# EAGLE schematic GloveControl_Module_20200316_0 (EAGLE 9.3.2)
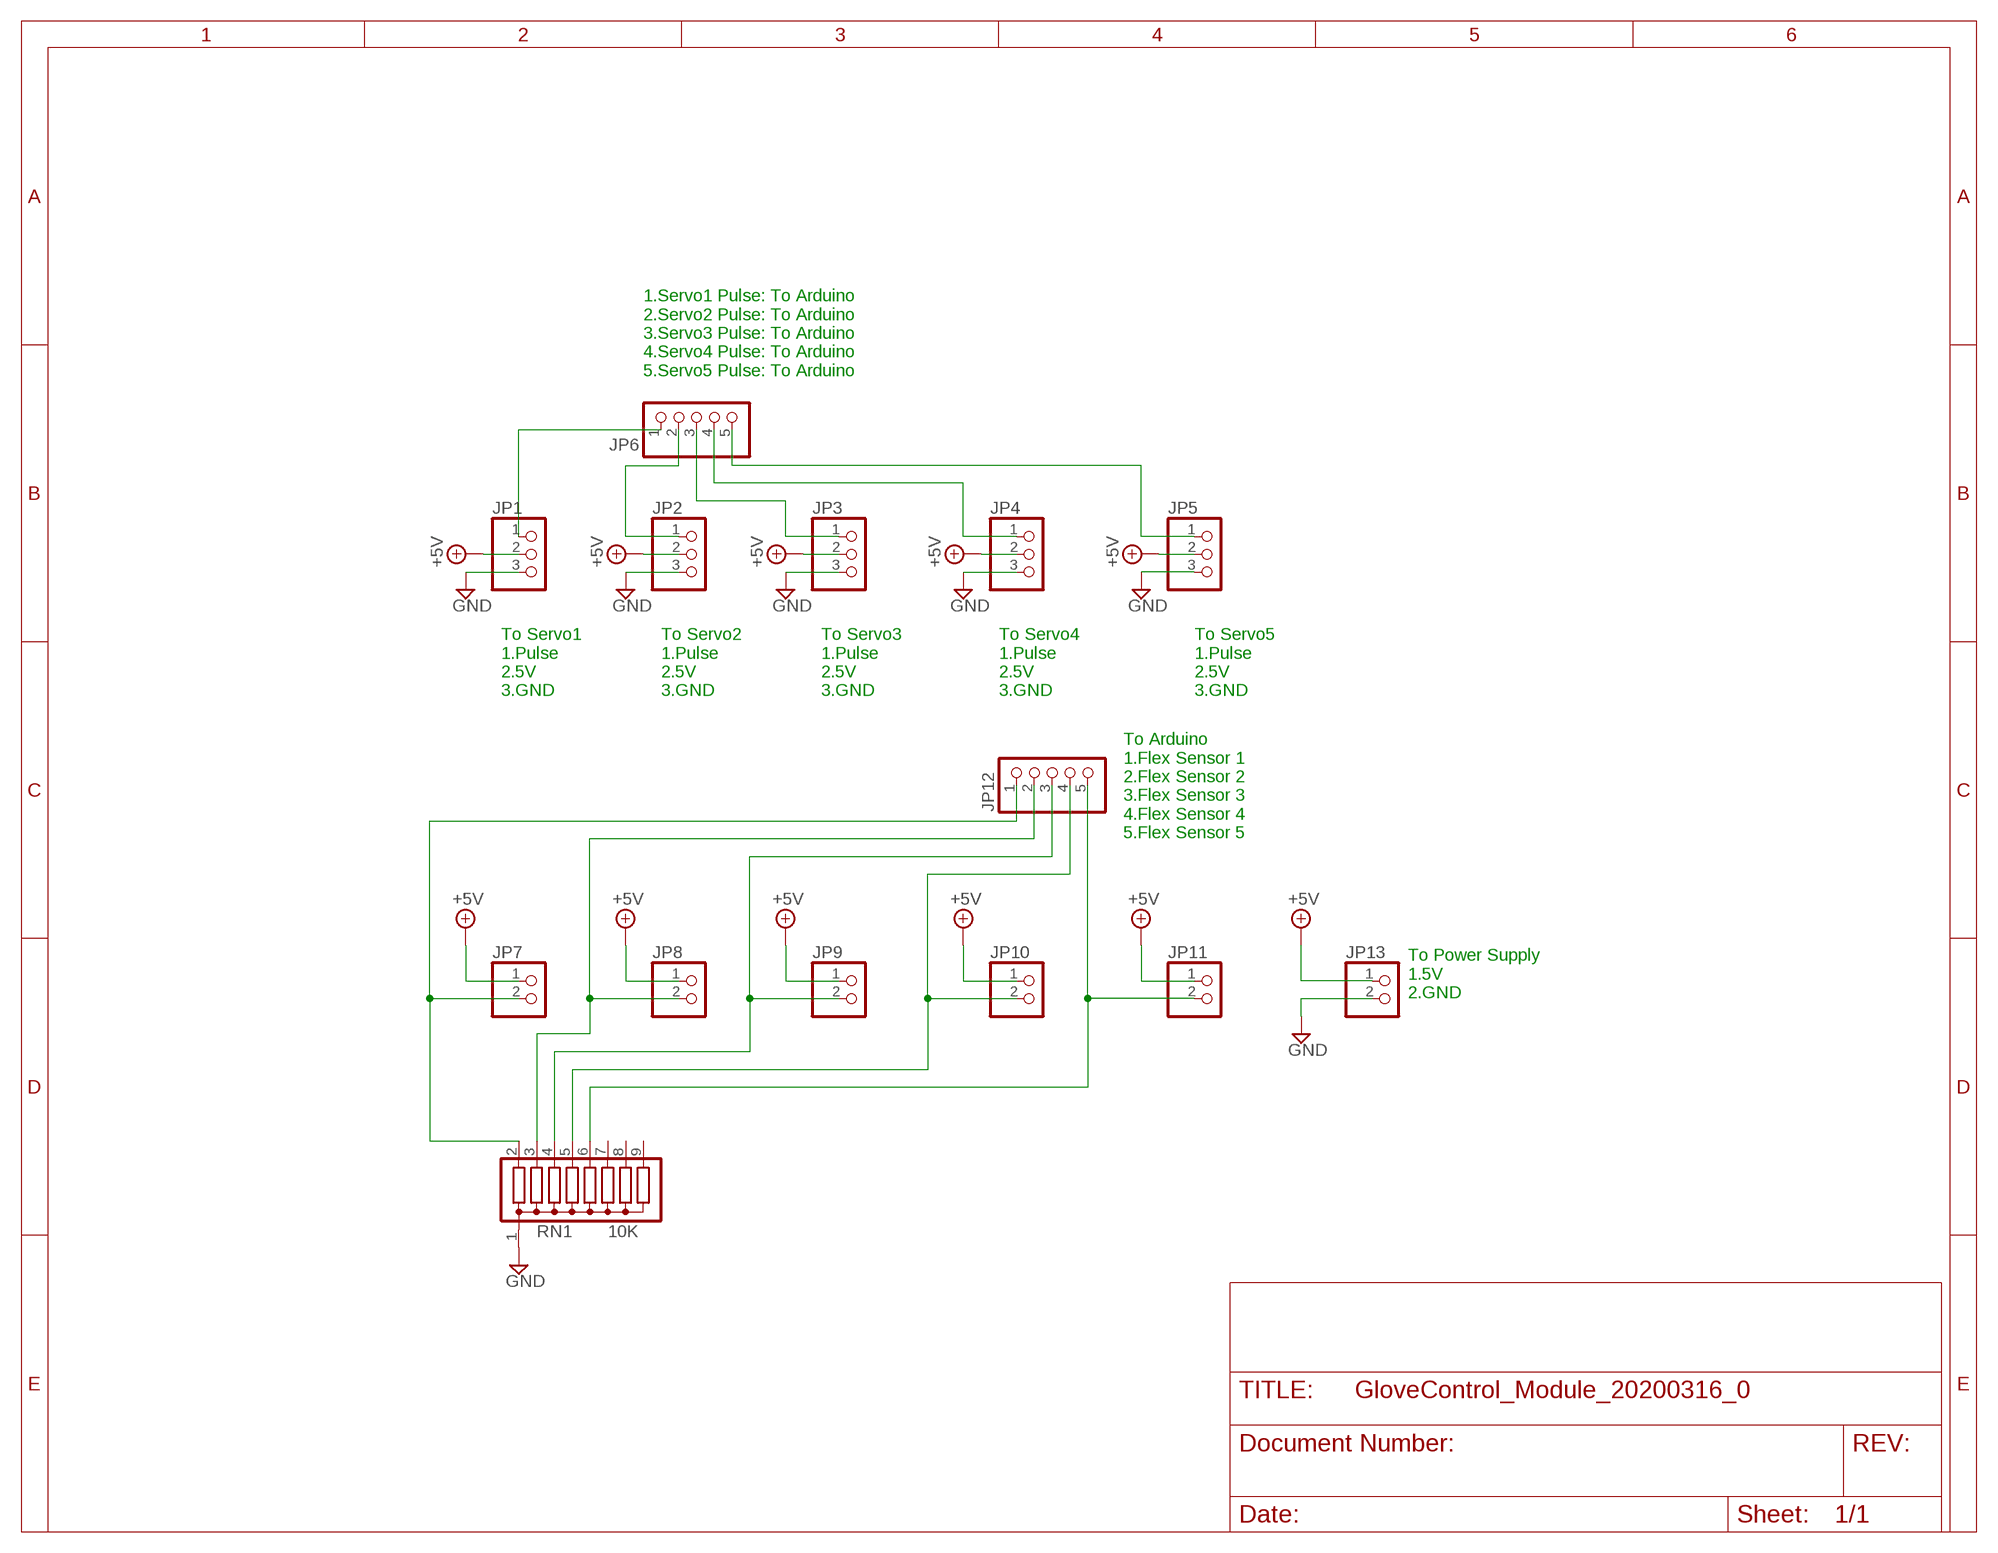
[diagram p0: schematic, sheet 1]

## Parts
JP1  PINHD-1X3  [1X03]
JP2  PINHD-1X3  [1X03]
JP3  PINHD-1X3  [1X03]
JP4  PINHD-1X3  [1X03]
JP5  PINHD-1X3  [1X03]
JP6  PINHD-1X5  [1X05]
JP7  PINHD-1X2  [1X02]
JP8  PINHD-1X2  [1X02]
JP9  PINHD-1X2  [1X02]
JP10  PINHD-1X2  [1X02]
JP11  PINHD-1X2  [1X02]
JP12  PINHD-1X5  [1X05]
JP13  PINHD-1X2  [1X02]
RN1  10K  G08R  [SIL9]

## Nets
+5V: JP1.2 JP2.2 JP3.2 JP4.2 JP5.2 JP7.1 JP8.1 JP9.1 JP10.1 JP11.1 JP13.1
GND: JP1.3 JP2.3 JP3.3 JP4.3 JP5.3 JP13.2 RN1.1
N$1: JP1.1 JP6.1
N$2: JP2.1 JP6.2
N$3: JP3.1 JP6.3
N$4: JP4.1 JP6.4
N$5: JP5.1 JP6.5
N$6: JP7.2 JP12.1 RN1.2
N$7: JP8.2 JP12.2 RN1.3
N$8: JP9.2 JP12.3 RN1.4
N$9: JP10.2 JP12.4 RN1.5
N$10: JP11.2 JP12.5 RN1.6
Unconnected: RN1.7 RN1.8 RN1.9

## Notes on the sheet
- 1.Servo1 Pulse: To Arduino
  2.Servo2 Pulse: To Arduino
  3.Servo3 Pulse: To Arduino
  4.Servo4 Pulse: To Arduino
  5.Servo5 Pulse: To Arduino
- To Servo1
  1.Pulse
  2.5V
  3.GND
- To Servo2
  1.Pulse
  2.5V
  3.GND
- To Servo3
  1.Pulse
  2.5V
  3.GND
- To Servo4
  1.Pulse
  2.5V
  3.GND
- To Servo5
  1.Pulse
  2.5V
  3.GND
- To Arduino
  1.Flex Sensor 1
  2.Flex Sensor 2
  3.Flex Sensor 3
  4.Flex Sensor 4
  5.Flex Sensor 5
- To Power Supply
  1.5V
  2.GND

## Library data of the parts
JP1-JP5 = pinhead:PINHD-1X3: PIN HEADER
JP6 JP12 = pinhead:PINHD-1X5: PIN HEADER
JP7-JP11 JP13 = pinhead:PINHD-1X2: PIN HEADER
RN1 = resistor-sil:G08R: SIL RESISTOR; OC_FARNELL: unknown; OC_NEWARK: unknown